# EAGLE design ESP32 Alarm (EAGLE 9.6.2)
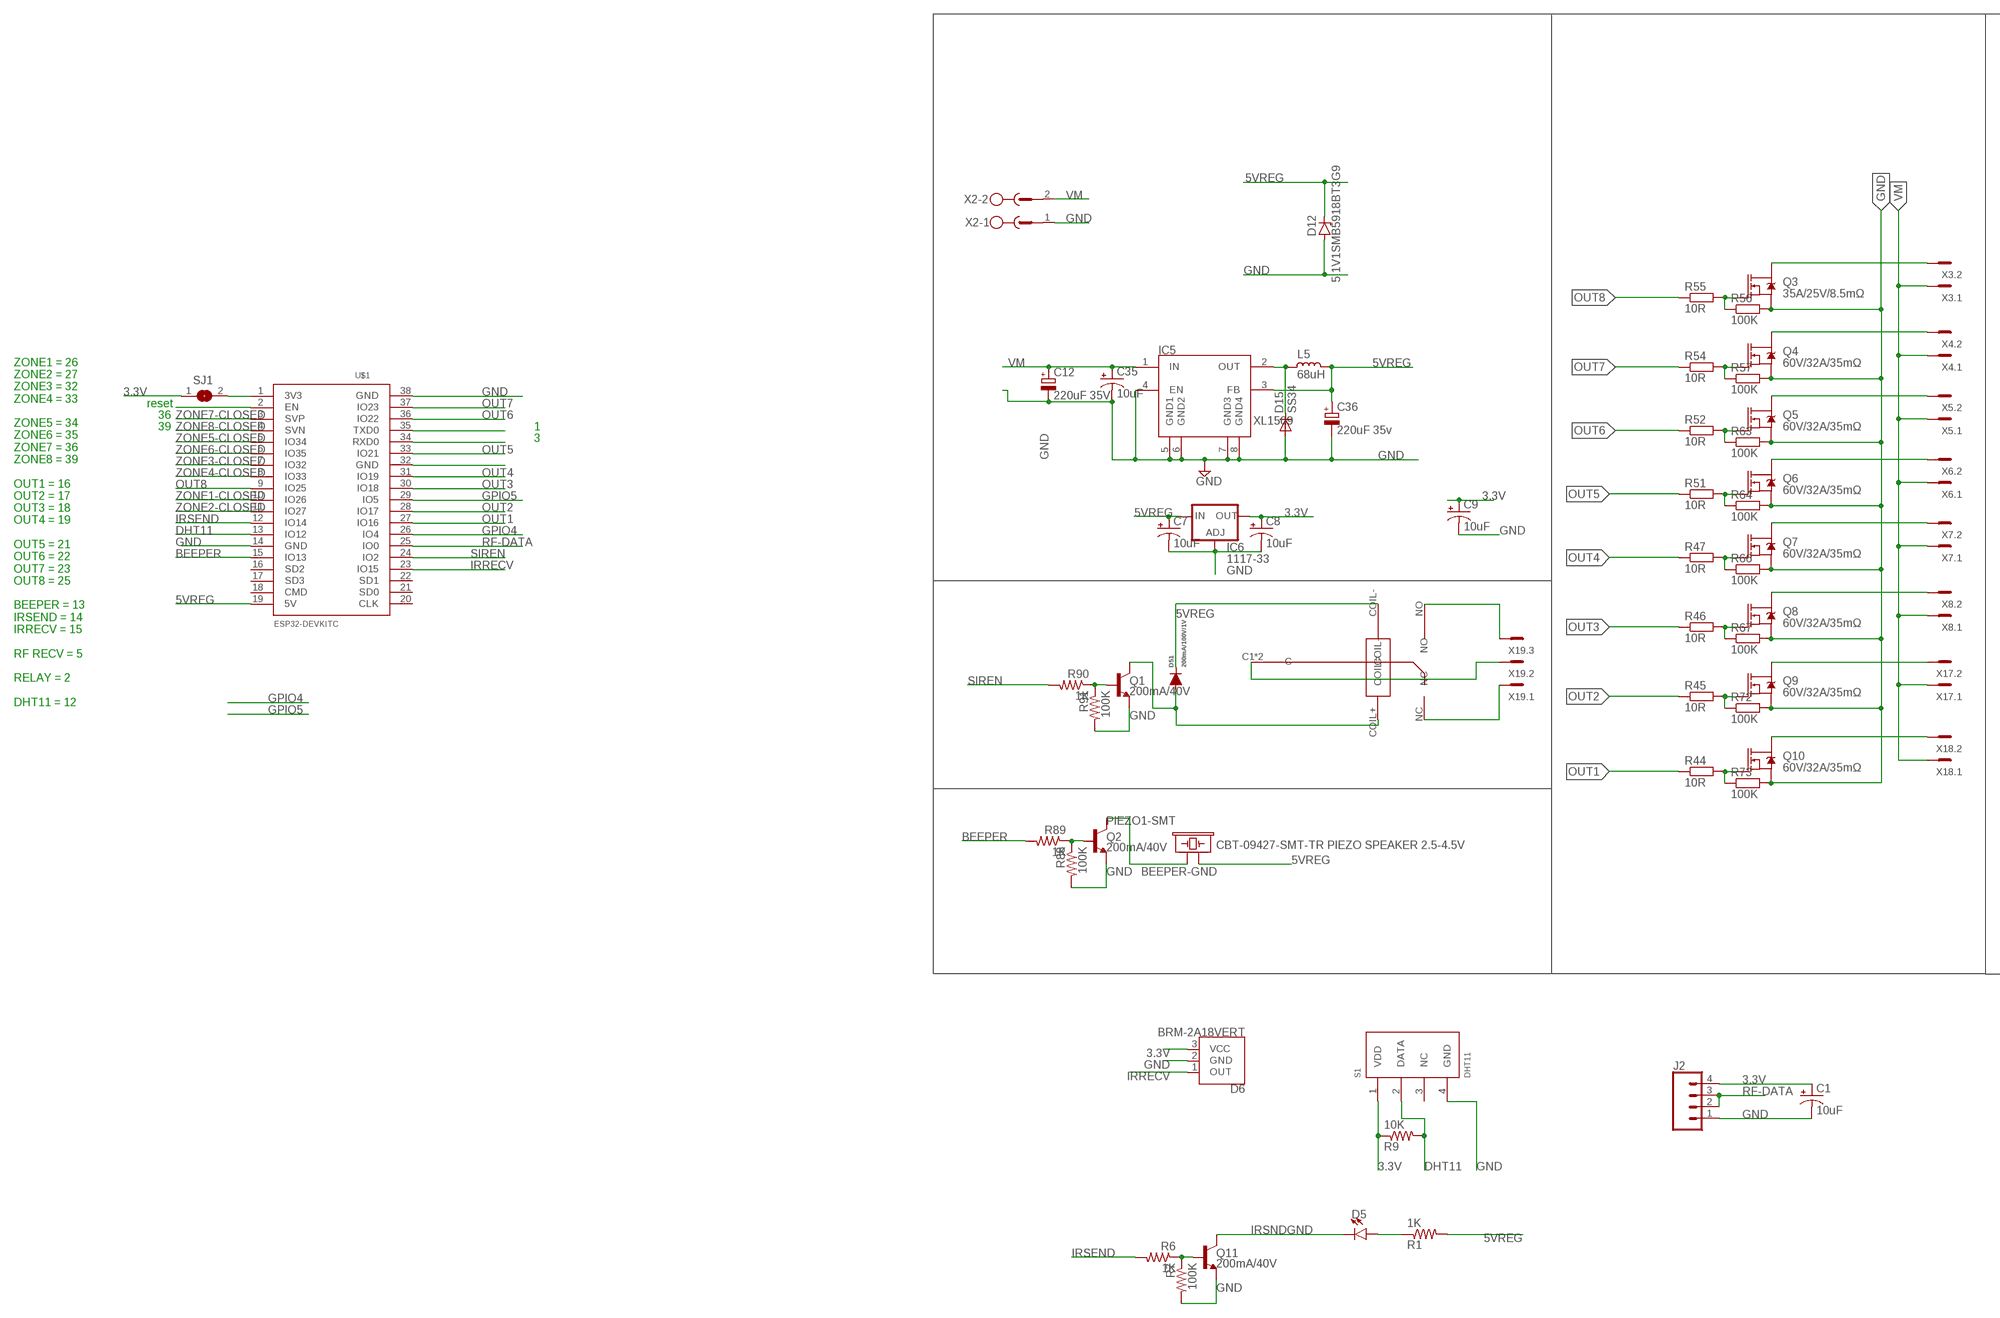
[diagram p0: schematic, sheet 1, part 1 of 2]
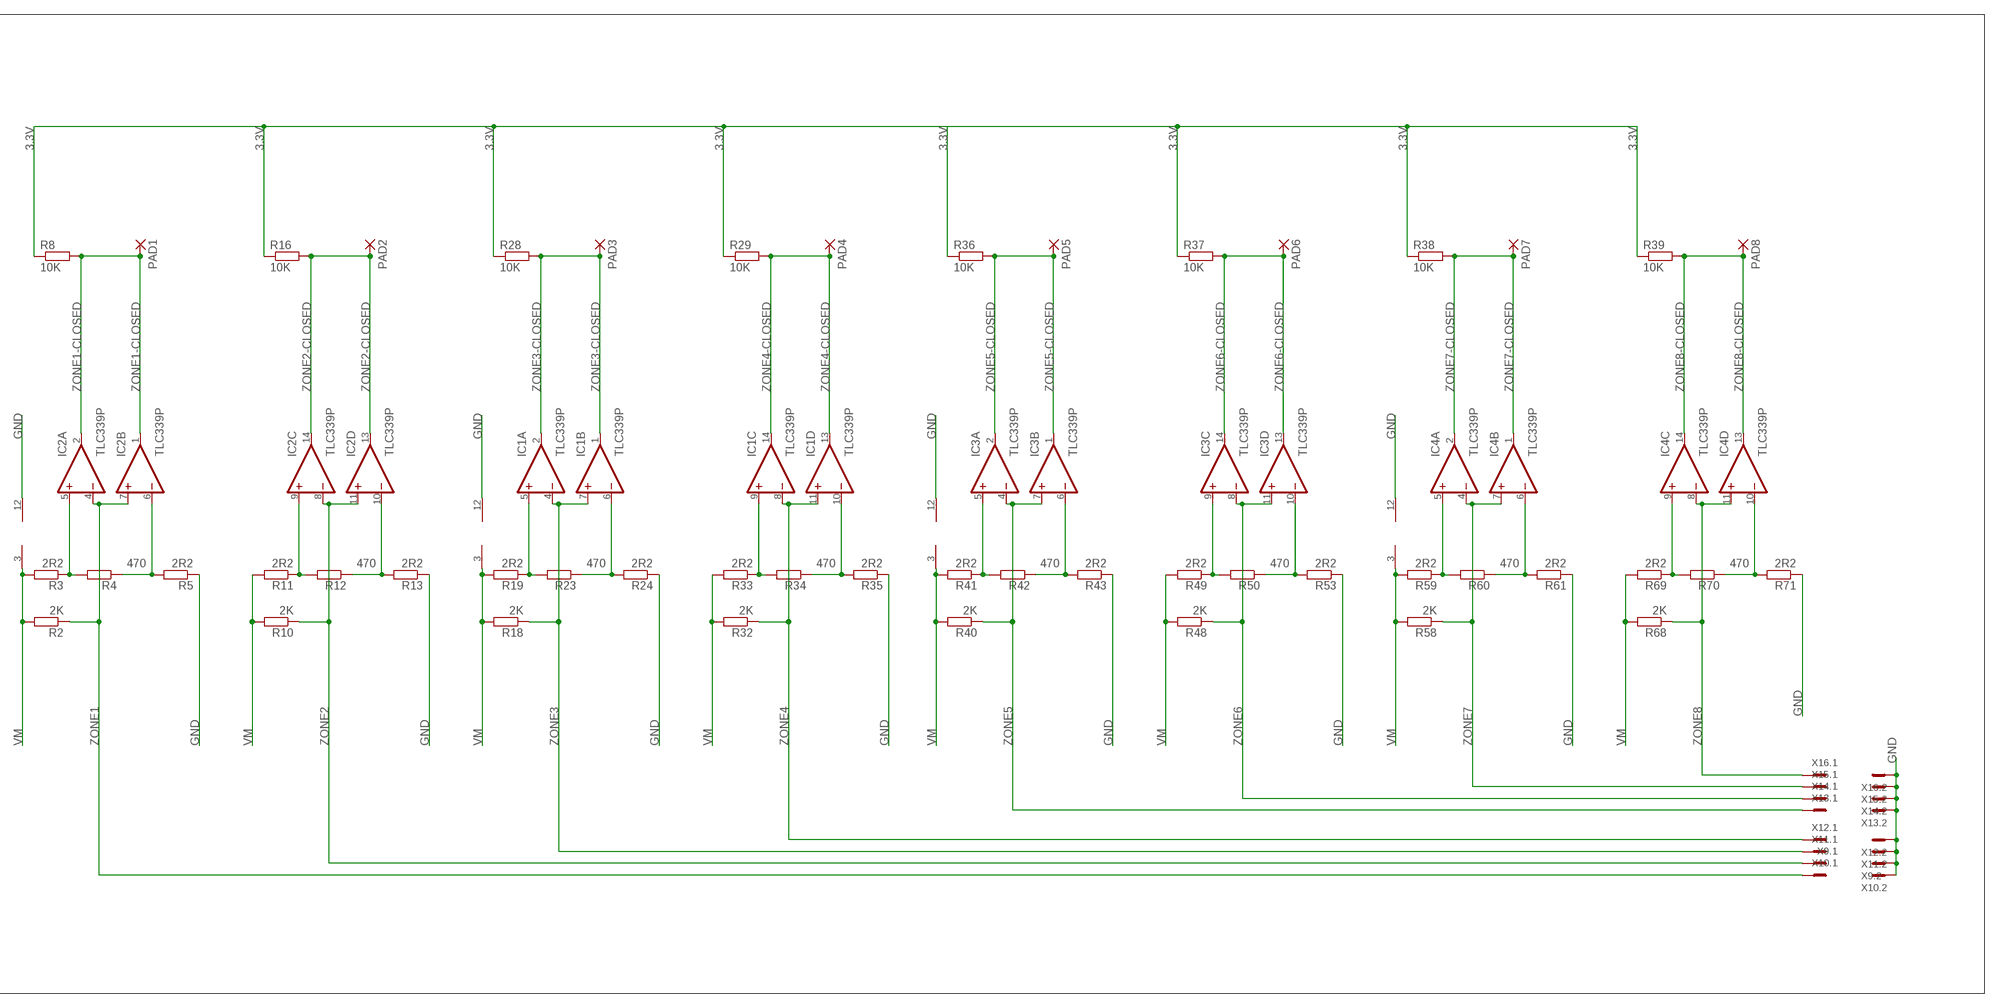
[diagram p1: schematic, sheet 1, part 2 of 2]

## Parts
C1  10uF  CAP_POL1206  [EIA3216]
C7  10uF  CAP_POL1206  [EIA3216]
C8  10uF  CAP_POL1206  [EIA3216]
C9  10uF  CAP_POL1206  [EIA3216]
C12  220uF 35V  CPOL-EUE3.5-8  [E3,5-8]
C35  10uF  CAP_POL1206  [EIA3216]
C36  220uF 35v  CPOL-EUE3.5-8  [E3,5-8]
D5  LED3MM  [LED_3MM]
D6  BRM-2A18VERT  [BRM-2508_VERT]
D12  5.1V1SMB5918BT3G9  ZENER-DIODESMB  [SMB]
D15  SS34  DIODE-DO-214AC  [DO-214AC]
D51  200mA/100V/1V  DIODE-KIT  [DIODE-1N4148-KIT]
IC1  TLC339P  [DIL14]
IC2  TLC339P  [DIL14]
IC3  TLC339P  [DIL14]
IC4  TLC339P  [DIL14]
IC5  XL1509  [SO08]
IC6  1117-33  LD117AS33TR  [SOT223]
J1  JRC-21F-4100  [JRC-21F-4100]
J2  CONN_04LOCK  [1X04_LOCK]
L5  68uH  L_CD75  [CD75]
PAD1  2,15/1,0  [2,15/1,0]
PAD2  2,15/1,0  [2,15/1,0]
PAD3  2,15/1,0  [2,15/1,0]
PAD4  2,15/1,0  [2,15/1,0]
PAD5  2,15/1,0  [2,15/1,0]
PAD6  2,15/1,0  [2,15/1,0]
PAD7  2,15/1,0  [2,15/1,0]
PAD8  2,15/1,0  [2,15/1,0]
PIEZO1-SMT  CBT-09427-SMT-TR PIEZO SPEAKER 2.5-4.5V  BUZZER-PTH  [BUZZER-12MM]
Q1  200mA/40V  TRANS_NPN-2N3904  [TO-92]
Q2  200mA/40V  TRANS_NPN-2N3904  [TO-92]
Q3  35A/25V/8.5mΩ  MOSFET-NCH-FDD8780  [DPAK]
Q4  60V/32A/35mΩ  MOSFET-NCH-FQP30N06L  [TO220V]
Q5  60V/32A/35mΩ  MOSFET-NCH-FQP30N06L  [TO220V]
Q6  60V/32A/35mΩ  MOSFET-NCH-FQP30N06L  [TO220V]
Q7  60V/32A/35mΩ  MOSFET-NCH-FQP30N06L  [TO220V]
Q8  60V/32A/35mΩ  MOSFET-NCH-FQP30N06L  [TO220V]
Q9  60V/32A/35mΩ  MOSFET-NCH-FQP30N06L  [TO220V]
Q10  60V/32A/35mΩ  MOSFET-NCH-FQP30N06L  [TO220V]
Q11  200mA/40V  TRANS_NPN-2N3904  [TO-92]
R1  1K  R-US_0204/7  [0204/7]
R2  2K  R-EU_0204/7  [0204/7]
R3  2R2  R-EU_0204/7  [0204/7]
R4  470  R-EU_0204/7  [0204/7]
R5  2R2  R-EU_0204/7  [0204/7]
R6  1K  R-US_0204/7  [0204/7]
R7  100K  R-US_0204/7  [0204/7]
R8  10K  R-EU_0204/7  [0204/7]
R9  10K  R-US_0204/7  [0204/7]
R10  2K  R-EU_0204/7  [0204/7]
R11  2R2  R-EU_0204/7  [0204/7]
R12  470  R-EU_0204/7  [0204/7]
R13  2R2  R-EU_0204/7  [0204/7]
R16  10K  R-EU_0204/7  [0204/7]
R18  2K  R-EU_0204/7  [0204/7]
R19  2R2  R-EU_0204/7  [0204/7]
R23  470  R-EU_0204/7  [0204/7]
R24  2R2  R-EU_0204/7  [0204/7]
R28  10K  R-EU_0204/7  [0204/7]
R29  10K  R-EU_0204/7  [0204/7]
R32  2K  R-EU_0204/7  [0204/7]
R33  2R2  R-EU_0204/7  [0204/7]
R34  470  R-EU_0204/7  [0204/7]
R35  2R2  R-EU_0204/7  [0204/7]
R36  10K  R-EU_0204/7  [0204/7]
R37  10K  R-EU_0204/7  [0204/7]
R38  10K  R-EU_0204/7  [0204/7]
R39  10K  R-EU_0204/7  [0204/7]
R40  2K  R-EU_0204/7  [0204/7]
R41  2R2  R-EU_0204/7  [0204/7]
R42  470  R-EU_0204/7  [0204/7]
R43  2R2  R-EU_0204/7  [0204/7]
R44  10R  R-EU_0204/7  [0204/7]
R45  10R  R-EU_0204/7  [0204/7]
R46  10R  R-EU_0204/7  [0204/7]
R47  10R  R-EU_0204/7  [0204/7]
R48  2K  R-EU_0204/7  [0204/7]
R49  2R2  R-EU_0204/7  [0204/7]
R50  470  R-EU_0204/7  [0204/7]
R51  10R  R-EU_0204/7  [0204/7]
R52  10R  R-EU_0204/7  [0204/7]
R53  2R2  R-EU_0204/7  [0204/7]
R54  10R  R-EU_0204/7  [0204/7]
R55  10R  R-EU_0204/7  [0204/7]
R56  100K  R-EU_0204/7  [0204/7]
R57  100K  R-EU_0204/7  [0204/7]
R58  2K  R-EU_0204/7  [0204/7]
R59  2R2  R-EU_0204/7  [0204/7]
R60  470  R-EU_0204/7  [0204/7]
R61  2R2  R-EU_0204/7  [0204/7]
R63  100K  R-EU_0204/7  [0204/7]
R64  100K  R-EU_0204/7  [0204/7]
R66  100K  R-EU_0204/7  [0204/7]
R67  100K  R-EU_0204/7  [0204/7]
R68  2K  R-EU_0204/7  [0204/7]
R69  2R2  R-EU_0204/7  [0204/7]
R70  470  R-EU_0204/7  [0204/7]
R71  2R2  R-EU_0204/7  [0204/7]
R72  100K  R-EU_0204/7  [0204/7]
R73  100K  R-EU_0204/7  [0204/7]
R88  100K  R-US_0204/7  [0204/7]
R89  1K  R-US_0204/7  [0204/7]
R90  1K  R-US_0204/7  [0204/7]
R91  100K  R-US_0204/7  [0204/7]
S1  DHT11  [DHT11]
SJ1  SJ  [SJ]
U$1  ESP32DEVKITC  [ESP32-DEVKITC]
X2  MSTBV2  [MSTBV2]
X3  MCV2  [MCV2]
X4  MCV2  [MCV2]
X5  MCV2  [MCV2]
X6  MCV2  [MCV2]
X7  MCV2  [MCV2]
X8  MCV2  [MCV2]
X9  MCV2  [MCV2]
X10  MCV2  [MCV2]
X11  MCV2  [MCV2]
X12  MCV2  [MCV2]
X13  MCV2  [MCV2]
X14  MCV2  [MCV2]
X15  MCV2  [MCV2]
X16  MCV2  [MCV2]
X17  MCV2  [MCV2]
X18  MCV2  [MCV2]
X19  MCV3  [MCV3]

## Nets
3.3V: C1.A(+) C8.A(+) C9.A(+) D6.3(VCC) IC6.4(OUT) J2.4 R8.1 R9.1 R16.1 R28.1 R29.1 R36.1 R37.1 R38.1 R39.1 S1.1(VDD) SJ1.1
5VREG: C7.A(+) C36.+ D12.C D51.C IC5.3(FB) IC6.3(IN) J1.COIL- L5.1 PIEZO1-SMT.+ R1.2 U$1.19(5V)
BEEPER: R89.2 U$1.15(IO13)
BEEPER-GND: PIEZO1-SMT.- Q2.3(C)
COIL-1: D51.A J1.COIL+(COIL=) Q1.3(C)
DHT11: R9.2 S1.2(DATA) U$1.13(IO12)
GND: C1.C(-) C7.C(-) C8.C(-) C9.C(-) C12.- C35.C(-) C36.- D6.2(GND) D12.A D15.2(A) IC1.12(P:V-) IC2.12(P:V-) IC3.12(P:V-) IC4.12(P:V-) IC5.4(EN) IC5.5(GND1) IC5.6(GND2) IC5.7(GND3) IC5.8(GND4) IC6.1(ADJ) J2.1 Q1.1(E) Q2.1(E) Q3.3(S) Q4.3(S) Q5.3(S) Q6.3(S) Q7.3(S) Q8.3(S) Q9.3(S) Q10.3(S) Q11.1(E) R5.1 R7.2 R13.1 R24.1 R35.1 R43.1 R53.1 R56.2 R57.2 R61.1 R63.2 R64.2 R66.2 R67.2 R71.1 R72.2 R73.2 R88.2 R91.2 S1.4(GND) U$1.14(GND) U$1.38(GND) X2.1 X9.2 X10.2 X11.2 X12.2 X13.2 X14.2 X15.2 X16.2
GPIO4: U$1.26(IO4)
GPIO5: U$1.29(IO5)
IRRECV: D6.1(OUT) U$1.23(IO15)
IRSEND: R6.2 U$1.12(IO14)
IRSNDGND: D5.K(C) Q11.3(C)
N$1: J1.C1(C) J1.C2(C) X19.2
N$2: IC2.5(A:+IN) R3.1 R4.2
N$3: D15.1(C) IC5.2(OUT) L5.2
N$4: IC2.6(B:-IN) R4.1 R5.2
N$5: IC1.5(A:+IN) R19.1 R23.2
N$6: IC1.6(B:-IN) R23.1 R24.2
N$7: Q9.2(D) X17.2
N$8: D5.A R1.1
N$9: Q11.2(B) R6.1 R7.1
N$11: Q2.2(B) R88.1 R89.1
N$13: IC2.9(C:+IN) R11.1 R12.2
N$14: IC2.10(D:-IN) R12.1 R13.2
N$16: Q10.1(G) R44.2 R73.1
N$17: J1.NC X19.1
N$18: Q9.1(G) R45.2 R72.1
N$19: Q8.1(G) R46.2 R67.1
N$20: IC1.9(C:+IN) R33.1 R34.2
N$21: IC1.10(D:-IN) R34.1 R35.2
N$23: Q7.1(G) R47.2 R66.1
N$24: IC3.5(A:+IN) R41.1 R42.2
N$25: IC3.6(B:-IN) R42.1 R43.2
N$26: J1.NO X19.3
N$27: Q6.1(G) R51.2 R64.1
N$28: IC3.9(C:+IN) R49.1 R50.2
N$29: IC3.10(D:-IN) R50.1 R53.2
N$30: SJ1.2 U$1.1(3V3)
N$31: Q5.1(G) R52.2 R63.1
N$32: IC4.5(A:+IN) R59.1 R60.2
N$33: IC4.6(B:-IN) R60.1 R61.2
N$35: Q4.1(G) R54.2 R57.1
N$36: IC4.9(C:+IN) R69.1 R70.2
N$37: Q3.1(G) R55.2 R56.1
N$38: IC4.10(D:-IN) R70.1 R71.2
N$41: Q3.4(D) X3.2
N$42: Q4.2(D) X4.2
N$43: Q5.2(D) X5.2
N$44: Q6.2(D) X6.2
N$45: Q7.2(D) X7.2
N$46: Q10.2(D) X18.2
N$47: Q8.2(D) X8.2
N$57: U$1.32(GND)
N$59: U$1.34(RXD0)
N$60: U$1.35(TXD0)
N$67: U$1.2(EN)
N$74: Q1.2(B) R90.1 R91.1
OUT1: R44.1 U$1.27(IO16)
OUT2: R45.1 U$1.28(IO17)
OUT3: R46.1 U$1.30(IO18)
OUT4: R47.1 U$1.31(IO19)
OUT5: R51.1 U$1.33(IO21)
OUT6: R52.1 U$1.36(IO22)
OUT7: R54.1 U$1.37(IO23)
OUT8: R55.1 U$1.9(IO25)
RF-DATA: J2.2 J2.3 U$1.25(IO0)
SIREN: R90.2 U$1.24(IO2)
VM: C12.+ C35.A(+) IC1.3(P:V+) IC2.3(P:V+) IC3.3(P:V+) IC4.3(P:V+) IC5.1(IN) R2.2 R3.2 R10.2 R11.2 R18.2 R19.2 R32.2 R33.2 R40.2 R41.2 R48.2 R49.2 R58.2 R59.2 R68.2 R69.2 X2.2 X3.1 X4.1 X5.1 X6.1 X7.1 X8.1 X17.1 X18.1
ZONE1: IC2.4(A:-IN) IC2.7(B:+IN) R2.1 X10.1
ZONE1-CLOSED: IC2.1(B:OUT) IC2.2(A:OUT) PAD1.1(P) R8.2 U$1.10(IO26)
ZONE2: IC2.8(C:-IN) IC2.11(D:+IN) R10.1 X9.1
ZONE2-CLOSED: IC2.13(D:OUT) IC2.14(C:OUT) PAD2.1(P) R16.2 U$1.11(IO27)
ZONE3: IC1.4(A:-IN) IC1.7(B:+IN) R18.1 X11.1
ZONE3-CLOSED: IC1.1(B:OUT) IC1.2(A:OUT) PAD3.1(P) R28.2 U$1.7(IO32)
ZONE4: IC1.8(C:-IN) IC1.11(D:+IN) R32.1 X12.1
ZONE4-CLOSED: IC1.13(D:OUT) IC1.14(C:OUT) PAD4.1(P) R29.2 U$1.8(IO33)
ZONE5: IC3.4(A:-IN) IC3.7(B:+IN) R40.1 X13.1
ZONE5-CLOSED: IC3.1(B:OUT) IC3.2(A:OUT) PAD5.1(P) R36.2 U$1.5(IO34)
ZONE6: IC3.8(C:-IN) IC3.11(D:+IN) R48.1 X14.1
ZONE6-CLOSED: IC3.13(D:OUT) IC3.14(C:OUT) PAD6.1(P) R37.2 U$1.6(IO35)
ZONE7: IC4.4(A:-IN) IC4.7(B:+IN) R58.1 X15.1
ZONE7-CLOSED: IC4.1(B:OUT) IC4.2(A:OUT) PAD7.1(P) R38.2 U$1.3(SVP)
ZONE8: IC4.8(C:-IN) IC4.11(D:+IN) R68.1 X16.1
ZONE8-CLOSED: IC4.13(D:OUT) IC4.14(C:OUT) PAD8.1(P) R39.2 U$1.4(SVN)
Unconnected: S1.3(NC) U$1.16(SD2) U$1.17(SD3) U$1.18(CMD) U$1.20(CLK) U$1.21(SD0) U$1.22(SD1)

## Notes on the sheet
- reset
- 36
- 39 | 1
- 3
- ZONE1 = 26 
  ZONE2 = 27
  ZONE3 = 32
  ZONE4 = 33
  
  ZONE5 = 34
  ZONE6 = 35
  ZONE7 = 36
  ZONE8 = 39
  
  OUT1 = 16
  OUT2 = 17
  OUT3 = 18
  OUT4 = 19
  
  OUT5 = 21
  OUT6 = 22
  OUT7 = 23
  OUT8 = 25
  
  BEEPER = 13
  IRSEND = 14
  IRRECV = 15
  
  RF RECV = 5
  
  RELAY = 2
  
  DHT11 = 12

## Library data of the parts
C1 C7-C9 C35 = SparkFun:CAP_POL: Capacitor Polarized These are standard SMD and PTH capacitors. Normally 10uF, 47uF, and 100uF in electrolytic and tantalum varieties. Always verify the external diameter of the through hole cap, it varies with capacity, voltage, and manufacturer. The EIA devices should be standard.
C12 C36 = rcl:CPOL-EU: POLARIZED CAPACITOR, European symbol
D5 = SparkFun-LED:LED: LED (Generic) Standard schematic elements and footprints for 5mm, 3mm, 1206, and 0603 sized LEDs. Generic LEDs with no color specified.; PROD_ID: DIO-08794
D6 = SparkFun-Sensors:BRM-2A18: BRM-2A18 IR Receiver The BRM-2A18 is miniaturized infrared receiver for remote control and other applications requiring improved ambient light rejection. Vertical package is a primary component on the ZX Distance and Gesture Sensor. RA package is not currently in-use. Example Datasheet <http://www.sinoskysun.com/upload/20110512/201105120447164615.PDF> SparkFun Products ZX Distance and Gesture Sensor <https://www.sparkfun.com/products/12780> (COM-12780); PROD_ID: COMP-12505
D12 = diode:ZENER-DIODE: Z-Diode
D15 = dp_devices:DIODE: Various Diode Packages
D51 = SparkFun-DiscreteSemi:DIODE: Diode These are standard reverse protection diodes and small signal diodes. SparkFun Products: SparkFun SparkPunk Sound Kit <https://www.sparkfun.com/products/11177> SparkFun ESP8266 Thing <https://www.sparkfun.com/products/13231>; PROD_ID: DIO-08378
IC1-IC4 = linear:TLC339: COMPARATOR
IC5 = Cohesion_parts:XL1509
IC6 = v-reg:LD117A?*: Low drop fixed and adjustable positive voltage regulators 1 A Source: http://www.st.com/stonline/products/literature/ds/7194/ld1117axx.pdf
J1 = JRC-21F:JRC-21F-4100
J2 = SparkFun-Connectors:CONN_04: Multi connection point. Often used as Generic Header-pin footprint for 0.1 inch spaced/style header connections On any of the 0.1 inch spaced packages, you can populate with these: Break Away Headers - Straight <https://www.sparkfun.com/products/116> (PRT-00116) Break Away Male Headers - Right Angle <https://www.sparkfun.com/products/553> (PRT-00553) Female Headers <https://www.sparkfun.com/products/115> (PRT-00115) Break Away Headers - Machine Pin <https://www.sparkfun.com/products/117> (PRT-00117) Break Away Female Headers - Swiss Machine Pin <https://www.sparkfun.com/products/743> (PRT-00743) For SCREWTERMINALS and SPRING TERMINALS visit here: Screw Terimnals on SparkFun.com <https://www.sparkfun.com/search/results?term=Screw+Terminals> (5mm/3.5mm/2.54mm spacing) This device is also useful as a general connection point to wire up your design to another part of your project. Our various solder wires solder well into these plated through hole pads. Hook-Up Wire - Assortment (Stranded, 22 AWG) <https://www.sparkfun.com/products/11375> (PRT-11375) Hook-Up Wire - Assortment (Solid Core, 22 AWG) <https://www.sparkfun.com/products/11367> (PRT-11367) View the entire wire category on our website here <https://www.sparkfun.com/categories/141> Special notes: Molex polarized connector foot print use with SKU : PRT-08231 with associated crimp pins and housings. 1MM SMD Version SKU: PRT-10208; PROD_ID: CONN-09696
L5 = rc-master-smd:L_: INDUCTOR
PAD1-PAD8 = wirepad:2,15/1,0: THROUGH-HOLE PAD
PIEZO1-SMT = SparkFun-Electromechanical:BUZZER: Buzzer Small round buzzers that operate around the audible 2kHz range. You can use these as speakers to create simple music or user interfaces. Variant Overview: PTH - Mini Speaker - PC Mount 12mm 2.048kHz <https://www.sparkfun.com/products/7950> PTH_KIT - Mini Speaker - PC Mount 12mm 2.048kHz <https://www.sparkfun.com/products/7950> KIT simplifies soldering by adding stop mask to one side of the pads. PTH_NO_SILK - Mini Speaker - PC Mount 12mm 2.048kHz <https://www.sparkfun.com/products/7950> No silkscreen indicator of buzzer outline. PTH_KIT_NO_SILK - Mini Speaker - PC Mount 12mm 2.048kHz <https://www.sparkfun.com/products/7950> KIT package w/o silkscreen SMD - Buzzer Audio Magnetic (CCV-084B16) SMD buzzer used on, e.g. the LilyPad Buzzer <https://www.sparkfun.com/products/8463> and RFID USB Reader <https://www.sparkfun.com/products/9963>. SMD_KIT - Buzzer Audio Magnetic (CCV-084B16) SMD Buzzer with elongated pins to make soldering easier. Used on the SparkFun Simon Says - Surface Mount Soldering Kit <https://www.sparkfun.com/products/10935>.; PROD_ID: COMP-08253; SF_SKU: COM-07950
Q1 Q2 Q11 = SparkFun-DiscreteSemi:TRANS_NPN: NPN transistor Current controlled devices typically used to amplify current or used as a switch. BC547 - COM-08928 <http://www.sparkfun.com/products/8928> (TO-92 45V 100mA) (1.Collector 2.Base 3.Emitter) 2N3904 - COM-00521 <http://www.sparkfun.com/products/521> (TO-92 40V 200mA) (1.Emitter 2.Base 3.Collector) P2N2222A - COM-12852 <http://www.sparkfun.com/products/12852> (TO-92 40V 600mA) (1.Collector 2.Base 3.Emitter); PROD_ID: TRANS-08447
Q3 = SparkFun-DiscreteSemi:MOSFET-NCH: N-channel MOSFETs Voltage controlled devices that allow control of high current outputs. SparkFun Products: SparkFun OpenScale <https://www.sparkfun.com/products/13261> SparkFun Digital Sandbox <https://www.sparkfun.com/products/12651> SparkFun Monster Moto Shield <https://www.sparkfun.com/products/10182> SparkFun MOSFET Power Controller <https://www.sparkfun.com/products/11214>; PROD_ID: TRANS-09984
Q4-Q10 = SparkFun-DiscreteSemi:MOSFET-NCH: N-channel MOSFETs Voltage controlled devices that allow control of high current outputs. SparkFun Products: SparkFun OpenScale <https://www.sparkfun.com/products/13261> SparkFun Digital Sandbox <https://www.sparkfun.com/products/12651> SparkFun Monster Moto Shield <https://www.sparkfun.com/products/10182> SparkFun MOSFET Power Controller <https://www.sparkfun.com/products/11214>; PROD_ID: TRANS-10060
R1 R6 R7 R9 R88-R91 = adafruit:R-US_: RESISTOR, American symbol
R2-R5 R8 R10-R13 R16 R18 R19 R23 R24 R28 R29 R32-R61 R63 R64 R66-R73 = rcl:R-EU_: RESISTOR, European symbol; SPICEPREFIX: R
S1 = dht:DHT11
SJ1 = jumper:SJ: SMD solder JUMPER
U$1 = ESP32-DEVKITC:ESP32DEVKITC
X2 = con-phoenix-500:MSTBV2: PHOENIX; OC_FARNELL: unknown; OC_NEWARK: unknown
X3-X18 = con-phoenix-381_l:MCV2: Mini-Combicon 3.81mm vertikal 2polig MCV 1,5/2-G-3,81 Artikel-Nr. 1803426
X19 = con-phoenix-381_l:MCV3: Mini-Combicon 3.81mm vertikal 3polig MCV 1,5/3-G-3,81 Artikel-Nr. 1803439

## Net classes
0 default: width 0.203 mm, clearance 0.152 mm
1 power: width 0.6 mm, clearance 0.305 mm

## Board
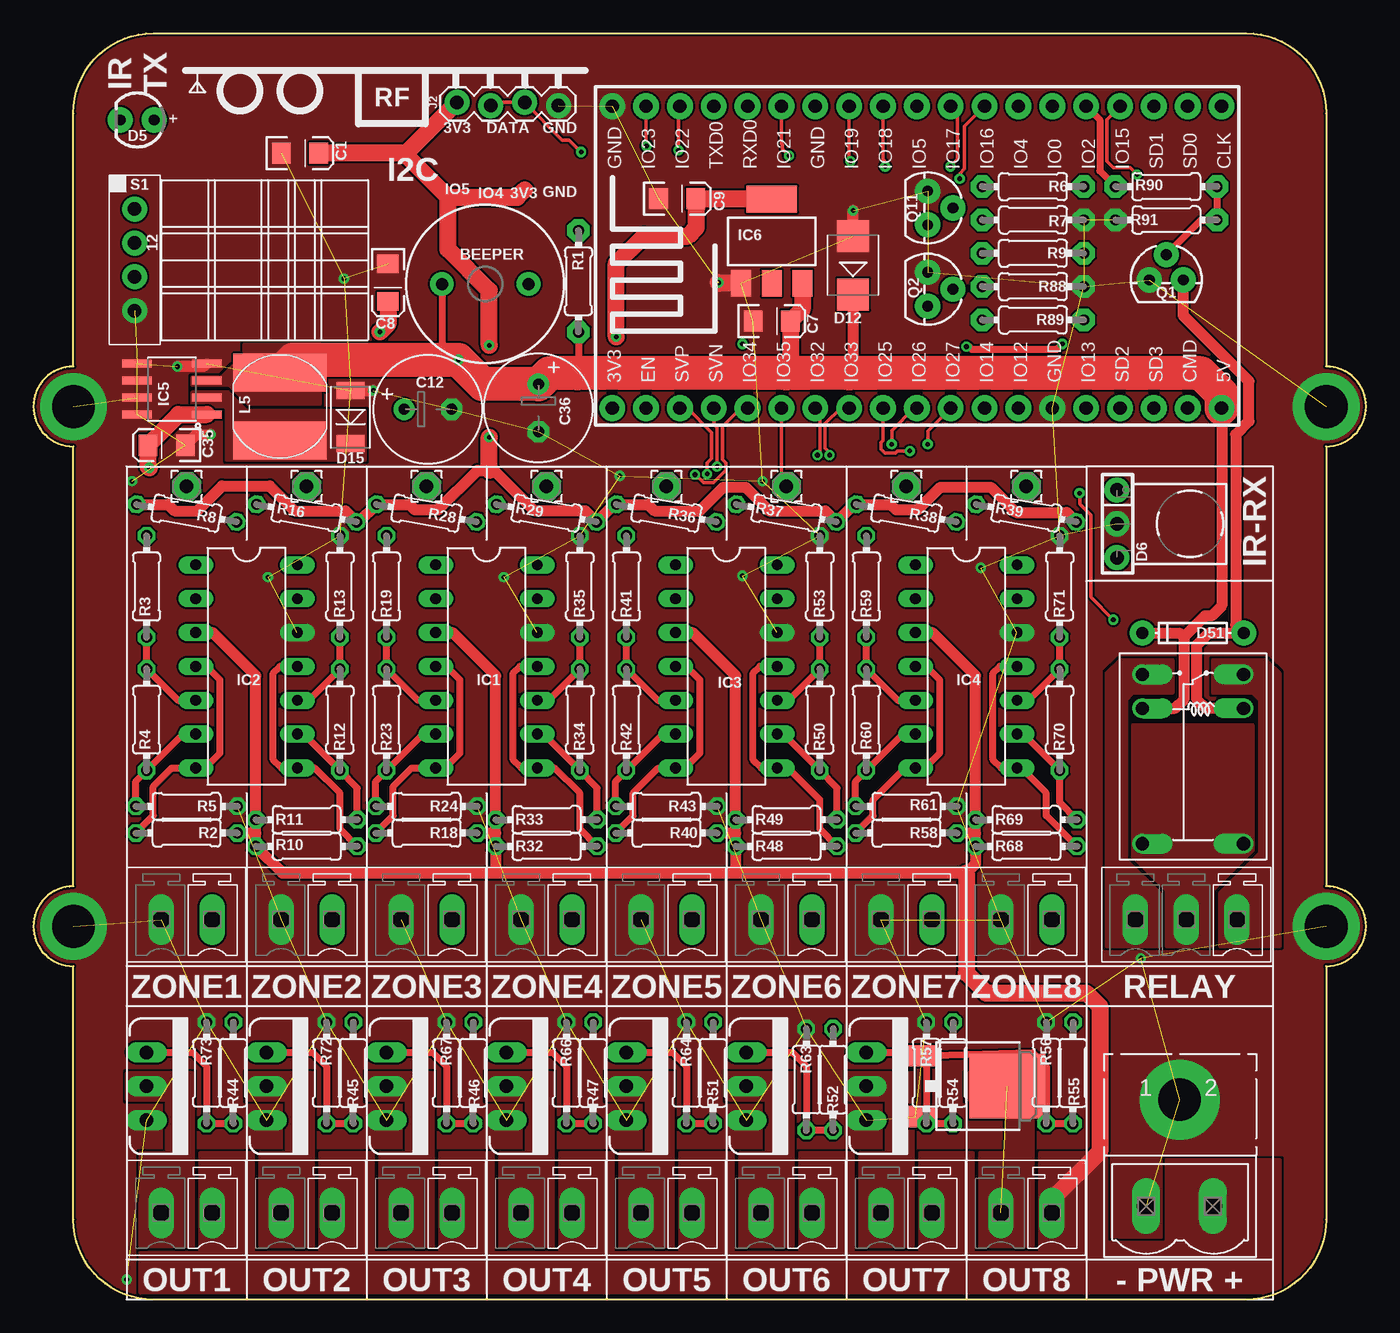
[diagram p2: board, top side]
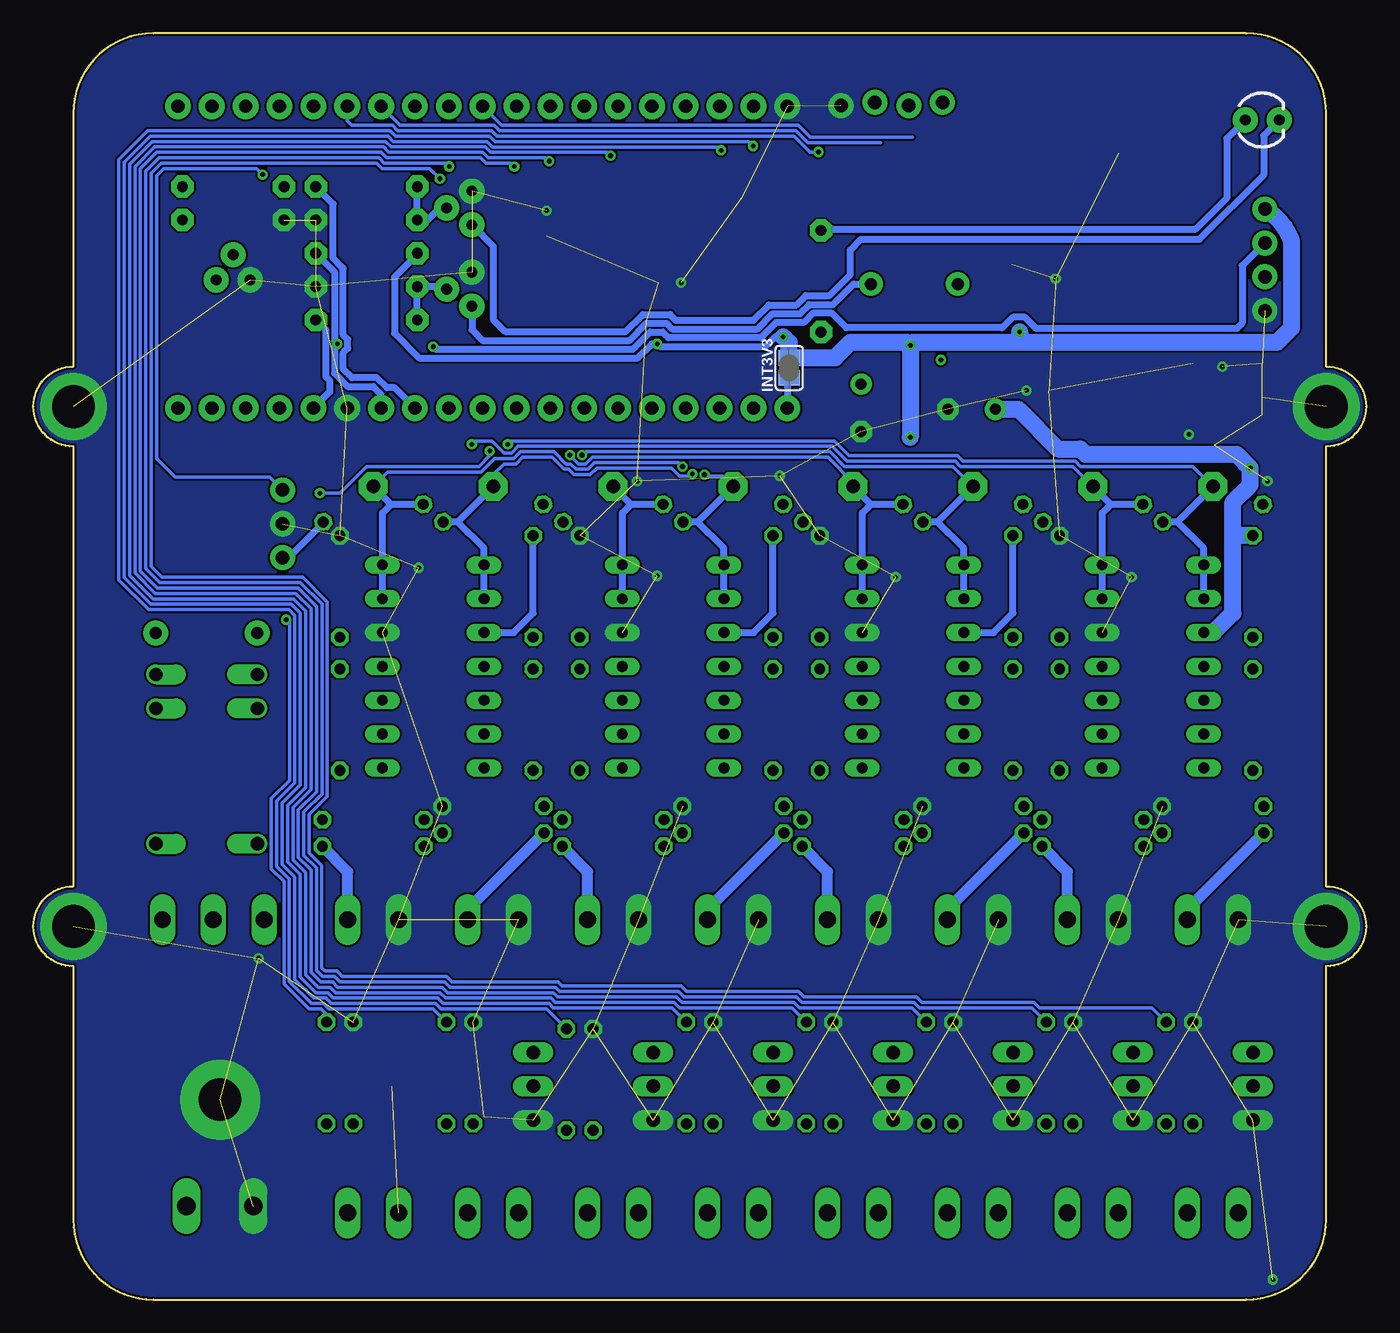
[diagram p3: board, bottom side, seen from below]

Size 100 x 95 mm. Coordinates in mm from the lower left corner, seen from the top.
Outline: 3,6 3,25 arc-180 3,31 3,64 arc-180 3,70 3,89 arc-90 9,95 91,95 arc-90 97,89 97,70 arc-180 97,64 97,31 arc-180 97,25 97,6 arc-90 91,0 9,0 arc-90 3,6
Copper layers (1*16): Top 0.035mm / dielectric 1.5mm / Bottom 0.035mm
Design rules "default *": minimum track width 6mil, minimum drill 0.35mm, track to track 6mil, track to pad 6mil, pad to pad 6mil, via to via 6mil, smd to smd 6mil, copper to edge 6mil, drill to drill 6mil, minimum pad ring 10mil, minimum via ring 8mil, stop-mask expansion 4mil, vias tented up to drill 0mil, thermal gap 10mil

### Footprints (pad centres in the part's own frame; a part is rotated, then mirrored left to right if it is on the bottom)
EIA3216 = smd 1.4 x 1.6: A 1.4,0; C -1.4,0
E3,5-8 = drill 0.813 pad 1.6: + -1.778,0 | drill 0.813 pad 1.6 octagon: - 1.778,0
LED_3MM = drill 0.813 pad 1.88: A -1.27,0; K 1.27,0
BRM-2508_VERT = drill 1.016 pad 1.88: 1 -2.54,0; 2 0,0; 3 2.54,0
SMB = smd 2.4 x 2.4: A 2.2,0; C -2.2,0
DO-214AC = smd 1.27 x 2.1: 1 -1.98,0; 2 1.98,0
DIODE-1N4148-KIT = drill 0.9 pad 1.88: A -3.81,0; C 3.81,0
DIL14 = drill 0.813 long: 1 -7.62,-3.81; 2 -5.08,-3.81; 3 -2.54,-3.81; 4 0,-3.81; 5 2.54,-3.81; 6 5.08,-3.81; 7 7.62,-3.81; 8 7.62,3.81; 9 5.08,3.81; 10 2.54,3.81; 11 0,3.81; 12 -2.54,3.81; 13 -5.08,3.81; 14 -7.62,3.81
SO08 = smd 0.61 x 2.21: 1 -1.905,-2.616; 2 -0.635,-2.616; 3 0.635,-2.616; 4 1.905,-2.616; 5 1.905,2.616; 6 0.635,2.616; 7 -0.635,2.616; 8 -1.905,2.616
SOT223 = smd 1.5 x 2: 1 -2.3,-3.15; 2 0,-3.15; 3 2.3,-3.15 | smd 3.8 x 2: 4 0,3.15
JRC-21F-4100 = drill 1 offset: C1 -4.3,3.8; C2 -4.3,-3.8; COIL+ 5.85,-3.8; COIL- 5.85,3.8; NC 8.4,-3.8; NO 8.4,3.8
1X04_LOCK = drill 1.016 pad 1.88: 1 0,0.127; 2 2.54,-0.127; 3 5.08,0.127; 4 7.62,-0.127
CD75 = smd 7 x 2.85: 1 0,2.54; 2 0,-2.54
2,15/1,0 = drill 1.016 pad 2.159 octagon: 1 0,0
BUZZER-12MM = drill 0.9 pad 1.778: + 3.25,0; - -3.25,0
TO-92 = drill 0.813 pad 1.88: 1 -1.27,0; 2 0,1.905; 3 1.27,0
DPAK = smd 1.6 x 3: 1 -2.28,-5.31; 3 2.28,-5.31 | smd 4.826 x 5.715: 4 0,1.588
TO220V = drill 1.016 long: 1 -2.54,0; 2 0,0; 3 2.54,0
0204/7 = drill 0.813 pad 1.676 octagon: 1 -3.81,0; 2 3.81,0
0204/7' = drill 0.813 octagon: 1 -3.81,0; 2 3.81,0
DHT11 = drill 1.016 pad 1.88: 1 -3.81,0; 2 -1.27,0; 3 1.27,0; 4 3.81,0
SJ = smd 1.168 x 1.6: 1 -0.762,0; 2 0.762,0
ESP32-DEVKITC = drill 1 pad 1.93: 1 -22.87,-11.42; 2 -20.33,-11.42; 3 -17.79,-11.42; 4 -15.25,-11.42; 5 -12.71,-11.42; 6 -10.17,-11.42; 7 -7.63,-11.42; 8 -5.09,-11.42; 9 -2.55,-11.42; 10 -0.01,-11.42; 11 2.53,-11.42; 12 5.07,-11.42; 13 7.61,-11.42; 14 10.15,-11.42; 15 12.69,-11.42; 16 15.23,-11.42; 17 17.77,-11.42; 18 20.31,-11.42; 19 22.85,-11.42; 20 22.85,11.23; 21 20.31,11.23; 22 17.77,11.23; 23 15.23,11.23; 24 12.69,11.23; 25 10.15,11.23; 26 7.61,11.23; 27 5.07,11.23; 28 2.53,11.23; 29 -0.01,11.23; 30 -2.55,11.23; 31 -5.09,11.23; 32 -7.63,11.23; 33 -10.17,11.23; 34 -12.71,11.23; 35 -15.25,11.23; 36 -17.79,11.23; 37 -20.33,11.23; 38 -22.87,11.23
MSTBV2 = drill 1.397 long: 1 -2.5,0; 2 2.5,0
MCV2 = drill 1.27 pad 1.905 long: 1 -1.905,0; 2 1.905,0
MCV3 = drill 1.27 pad 1.905 long: 1 -3.81,0; 2 0,0; 3 3.81,0

### Placement (x,y rotation side)
C1  20,86 0 top
C7  55.4,73.4 0 top
C8  26.6,76.3 270 top
C9  48.3,82.6 0 top
C12  29.6,66.8 0 top
C35  10,64.1 180 top
C36  37.9,66.9 270 top
D5  7.8,88.5 180 top
D6  81.3,58.2 270 top
D12  61.5,77.6 90 top
D15  23.8,66.2 90 top
D51  87,50 180 top
IC1  34,47.5 270 top
IC2  16,47.5 270 top
IC3  52,47.5 270 top
IC4  70,47.5 270 top
IC5  10.4,68.3 90 top
IC6  55.4,79.4 0 top
J1  87,38.5 90 top
J2  39.4,89.7 180 top
L5  18.5,67 0 top
PAD1  11.5,61 0 top
PAD2  20.5,61 0 top
PAD3  29.5,61 0 top
PAD4  38.5,61 0 top
PAD5  47.5,61 0 top
PAD6  56.5,61 0 top
PAD7  65.5,61 0 top
PAD8  74.5,61 0 top
PIEZO1-SMT  33.9,76.2 180 top
Q1  85,76.5 0 top
Q2  67.1,75.8 270 top
Q3  71.5,16 270 top
Q4  62.5,16 270 top
Q5  53.5,16 270 top
Q6  44.5,16 270 top
Q7  35.5,16 270 top
Q8  26.5,16 270 top
Q9  17.5,16 270 top
Q10  8.5,16 270 top
Q11  67.1,81.9 270 top
R1  40.9,76.4 270 top
R2  2K  [0204/7']  11.5,35 0 top
R3  2R2  [0204/7']  8.5,53.5 90 top
R4  470  [0204/7']  8.5,43.5 90 top
R5  2R2  [0204/7']  11.5,37 180 top
R6  75,83.5 0 top
R7  75,81 0 top
R8  10K  [0204/7']  11.5,59 350 top
R9  75,78.5 0 top
R10  2K  [0204/7']  20.5,34 180 top
R11  2R2  [0204/7']  20.5,36 180 top
R12  470  [0204/7']  23,43.5 270 top
R13  2R2  [0204/7']  23,53.5 270 top
R16  10K  [0204/7']  20.5,59 170 top
R18  2K  [0204/7']  29.5,35 0 top
R19  2R2  [0204/7']  26.5,53.5 90 top
R23  470  [0204/7']  26.5,43.5 90 top
R24  2R2  [0204/7']  29.5,37 180 top
R28  10K  [0204/7']  29.5,59 350 top
R29  10K  [0204/7']  38.5,59 170 top
R32  2K  [0204/7']  38.5,34 180 top
R33  2R2  [0204/7']  38.5,36 180 top
R34  470  [0204/7']  41,43.5 270 top
R35  2R2  [0204/7']  41,53.5 270 top
R36  10K  [0204/7']  47.5,59 350 top
R37  10K  [0204/7']  56.5,59 170 top
R38  10K  [0204/7']  65.5,59 350 top
R39  10K  [0204/7']  74.5,59 170 top
R40  2K  [0204/7']  47.5,35 0 top
R41  2R2  [0204/7']  44.5,53.5 90 top
R42  470  [0204/7']  44.5,43.5 90 top
R43  2R2  [0204/7']  47.5,37 180 top
R44  10R  [0204/7']  15,17 270 top
R45  10R  [0204/7']  24,17 270 top
R46  10R  [0204/7']  33,17 270 top
R47  10R  [0204/7']  42,17 270 top
R48  2K  [0204/7']  56.5,34 180 top
R49  2R2  [0204/7']  56.5,36 180 top
R50  470  [0204/7']  59,43.5 270 top
R51  10R  [0204/7']  51,17 270 top
R52  10R  [0204/7']  60,16.5 270 top
R53  2R2  [0204/7']  59,53.5 270 top
R54  10R  [0204/7']  69,17 270 top
R55  10R  [0204/7']  78,17 270 top
R56  100K  [0204/7']  76,17 90 top
R57  100K  [0204/7']  67,17 90 top
R58  2K  [0204/7']  65.5,35 0 top
R59  2R2  [0204/7']  62.5,53.5 90 top
R60  470  [0204/7']  62.5,43.5 90 top
R61  2R2  [0204/7']  65.5,37 180 top
R63  100K  [0204/7']  58,16.5 90 top
R64  100K  [0204/7']  49,17 90 top
R66  100K  [0204/7']  40,17 90 top
R67  100K  [0204/7']  31,17 90 top
R68  2K  [0204/7']  74.5,34 180 top
R69  2R2  [0204/7']  74.5,36 180 top
R70  470  [0204/7']  77,43.5 270 top
R71  2R2  [0204/7']  77,53.5 270 top
R72  100K  [0204/7']  22,17 90 top
R73  100K  [0204/7']  13,17 90 top
R88  75,76 0 top
R89  75,73.5 0 top
R90  85,83.5 180 top
R91  85,81 180 top
S1  7.6,78 270 top
SJ1  43.3,69.9 270 bottom
U$1  66.3,78.3 0 top
X2  86,7 0 top
X3  74.5,6.5 180 top
X4  65.5,6.5 180 top
X5  56.5,6.5 180 top
X6  47.5,6.5 180 top
X7  38.5,6.5 180 top
X8  29.5,6.5 180 top
X9  20.5,28.5 180 top
X10  11.5,28.5 180 top
X11  29.5,28.5 180 top
X12  38.5,28.5 180 top
X13  47.5,28.5 180 top
X14  56.5,28.5 180 top
X15  65.5,28.5 180 top
X16  74.5,28.5 180 top
X17  20.5,6.5 180 top
X18  11.5,6.5 180 top
X19  86.5,28.5 180 top

### Tracks (layer width: path | path; a pad name or v marks a point on that pad's centre or on a via)
3.3V  (via drill 0.35)
  Top 0.813: R8.1 10.12,59.66 10.62,59.16 12.28,59.16 14.17,61.05 17.73,61.05 19.62,59.16 23.43,59.16 R16.1 24.43,58.34 R28.1 28.22,59.66 28.62,59.26 30.38,59.26 33.32,62.2 34.2,62.2 34.58,62.2 37.62,59.16 41.43,59.16 R29.1 43.58,59.66 R36.1 46.12,59.66 46.62,59.16 49.98,59.16 51.77,60.95 53.43,60.95 55.22,59.16 59.43,59.16 R37.1 61.58,59.66 R38.1 64.32,59.66 64.72,59.26 66.38,59.26 68.07,60.95 71.83,60.95 73.72,59.06 77.53,59.06 R39.1
  Top 1.27: IC6.4 49.75,82.55 | 49.75,82.55 C9.A | v43.73,72.23 43.73,77.73 45.8,79.8 49.1,79.8 49.75,80.45 49.75,82.55 | J2.4 27.95,86 | 27.95,86 C1.A | v34.2,71.6 34.2,75.7 31.1,78.8 31.1,82.7 | 27.95,86 27.95,85.85 31.1,82.7 | 31.1,82.7 36.3,82.7 36.86,83.26 | 34.2,62.2 v34.2,64.7 | C8.A 26.6,73.2 v26,72.6
  Bottom 0.508: v43.73,72.23 44.33,72.23 45.06,71.5 53,71.5 v53.2,71.7 53.6,71.7 54.66,70.64 71.04,70.64 72.9,72.5 72.9,76.7 71.19,78.41 R9.1 | R39.1 78.25,58.24 80.83,55.66 D6.3
  Bottom 1.27: v34.2,71.6 34.42,71.82 38.68,71.82 39.84,70.66 SJ1.1 43.3,71.8 v43.73,72.23 | v34.2,71.6 33.98,71.82 25.9,71.82 | 25.9,71.82 6.68,71.82 5.6,72.9 5.6,79.4 arc-41 S1.1 | v34.2,71.6 v34.2,64.7 | v26,72.6 26,71.92 25.9,71.82
5VREG  (via drill 0.35)
  Top 0.508: R1.2 40.9,69.6 40.8,69.5 | PIEZO1-SMT.+ 30.65,70.5
  Top 0.813: J1.COIL- 85.65,44.35 86.3,45 86.3,49.7 | D12.C 61.5,69.8 61.2,69.5 | U$1.19 89.15,52.05 88.4,51.3 87.9,51.3 86.3,49.7 | D51.C 86,50 86.3,49.7
  Top 1.27: 56.5,69.5 56.8,69.8 C7.A 57.7,74.3 IC6.3
  Top 2.54: U$1.19 89.15,67.95 87.6,69.5 61.2,69.5 56.5,69.5 40.8,69.5 38.72,69.5 C36.+ 33.72,68.68 v31.9,70.5 30.65,70.5 19.46,70.5 L5.1
  pour Top (no thermals): 11.9,68.6 14.7,68.6 16.1,67.2 21.5,67.2 21.5,71.7 15.8,71.7 15.8,70.9 14.1,69.2 11.9,69.2
BEEPER
  Bottom 0.508: R89.2 78.06,72.75 78.06,69.23 77.77,68.93 77.77,68.1 U$1.15
BEEPER-GND
  Bottom 0.508: Q2.3 67.1,72.76 66.3,71.96 55.28,71.96 54,73.25 52.5,73.25 52.08,72.82 45.68,72.82 44.54,73.96 42.47,73.96 41.77,74.66 40.01,74.66 38.47,76.2 PIEZO1-SMT.-
COIL-1
  Top 0.813: J1.COIL+ 87.95,44.35 87.3,45 87.3,49.1 88.2,50 D51.A 90.2,50.61 90.2,64.9 91.2,65.9 91.2,68.9 86.27,73.83 Q1.3
DHT11  (via drill 0.35)
  Top 0.508: v70,71.5 70.2,71.5 70.4,71.3 76.8,71.3 v77.2,71.7
  Bottom 0.508: U$1.13 73.91,67.91 74.5,68.5 76.4,68.5 77.4,69.5 77.4,71.5 v77.2,71.7 77.4,71.9 77.4,77.09 R9.2 | v70,71.5 69.8,71.3 55.01,71.3 53.73,72.58 52.77,72.58 52.35,72.16 45.41,72.16 44.27,73.3 42.2,73.3 41.5,74 40.1,74 39,72.9 27.3,72.9 26.5,73.7 25.6,73.7 24.76,72.86 9.7,72.86 9.3,73.26 9.3,77.57 S1.2
GND  (via drill 0.35, 3.2 pad 5, 3.2 pad 6)  (77 unrouted)
  Top 0.813: C35.C 12.2,64.9 v13.3,64.9 | IC5.4 12.81,70 v10.8,70 | D15.2 25.48,68.18 v25.5,68.2 | D12.A v61.5,81.7
  Top 1.27: IC6.1 51.45,76.25 v51.4,76.3
  other vias: 7.4,61.4 7,1.5 83.1,25.6 71.1,54.9 53.2,54.3 35.3,54.2 17.6,54.2 44,61.8 54.7,61.4 86,15 23.3,76.6 3,67 97,67 97,28 3,28
  pour Top (rank 6, no thermals): 0,0 100,0 100,100 0,100
  pour Bottom (rank 6, no thermals): 0,0 100,0 100,100 0,100
GPIO4
  Bottom 0.254: 36.44,86.79 41.87,86.79 42.77,87.69 65.03,87.69 65.44,88.11 72.49,88.11 U$1.26
GPIO5
  Bottom 0.254: 34.05,87.2 41.7,87.2 42.61,88.11 46.27,88.11 46.28,88.1 64.86,88.1 U$1.29
IRRECV  (via drill 0.35)
  Top 0.254: v82.8,84.4 82.3,84.9 81.03,84.9 80.53,85.4 80.53,88.53 U$1.23
  Bottom 0.254: D6.1 82.26,61.7 89.35,61.7 90.75,63.1 90.75,84.33 90.22,84.86 83.25,84.86 v82.8,84.4
IRSEND
  Bottom 0.508: U$1.12 72.89,68.4 73.47,68.4 74.23,69.16 76.1,69.16 76.74,69.8 76.74,71.05 76.42,71.38 76.42,72.03 76.74,72.35 76.74,77.36 76.84,77.46 76.89,77.51 77.5,78.12 77.5,82.19 R6.2
IRSNDGND
  Bottom 0.508: Q11.3 65.5,79.03 65.5,73.52 64.6,72.62 55.56,72.62 54.27,73.91 52.23,73.91 51.8,73.48 45.96,73.48 44.82,74.62 42.75,74.62 42.05,75.32 40.28,75.32 38.7,76.9 38.7,78.75 37.9,79.55 12.52,79.55 7.7,84.37 7.7,87.33 D5.K
N$1
  pour Top (no thermals): 82.5,43.1 82.5,33.2 85,30.7 85,26.5 88.5,26.5 88.5,30.7 91.5,33.7 91.5,43.1
N$2
  Top 0.508: IC2.5 10.85,44.96 R4.2 R3.1
N$3
  pour Top (no thermals): 11.9,67 14.3,67 14.5,66.8 14.5,63 24.9,63 24.9,66.7 16,66.7 14.6,68.1 11.9,68.1
N$4
  Top 0.508: IC2.6 11.23,42.42 R4.1 7.69,38.88 R5.2
N$5
  Top 0.508: IC1.5 28.85,44.96 R23.2 R19.1
N$6
  Top 0.508: IC1.6 29.23,42.42 R23.1 25.69,38.88 R24.2
N$7
  pour Top (no thermals): 16,15 19,15 19,11 17,11 17,4 21,4 21,17 16,17
N$8
  Bottom 0.508: R1.1 40.8,80.31 12.79,80.31 10.46,82.64 10.46,87.11 D5.A
N$9
  Bottom 0.508: R6.1 R7.1 70.4,81 69.5,81.9 Q11.2
N$11
  Bottom 0.508: R89.1 R88.1 69.2,76 Q2.2
N$13
  Top 0.508: IC2.9 20.27,42.42 R12.2 24.31,38.38 R11.1
N$14
  Top 0.508: IC2.10 20.65,44.96 R12.1 R13.2
N$16
  Top 0.508: Q10.1 11.96,18.54 13,17.5 R73.1 R44.2
N$17
  pour Top (no thermals): 89,26.5 89,30.5 92,33.5 92,45 91.5,45.5 88.5,45.5 88.5,48 92.5,48 93.5,47 93.5,26.5
N$18
  Top 0.508: Q9.1 20.96,18.54 22,17.5 R72.1 R45.2
N$19
  Top 0.508: Q8.1 29.96,18.54 31,17.5 R67.1 R46.2
N$20
  Top 0.508: IC1.9 38.27,42.42 R34.2 42.31,38.38 R33.1
N$21
  Top 0.508: IC1.10 38.65,44.96 R34.1 R35.2
N$23
  Top 0.508: Q7.1 38.96,18.54 40,17.5 R66.1 R47.2
N$24
  Top 0.508: IC3.5 46.85,44.96 R42.2 R41.1
N$25
  Top 0.508: IC3.6 47.23,42.42 R42.1 43.69,38.88 R43.2
N$26
  pour Top (no thermals): 84.5,26.5 84.5,30.5 82,33 82,45 82.5,45.5 85.5,45.5 85.5,48 81.5,48 80.5,47 80.5,26.5
N$27
  Top 0.508: Q6.1 47.96,18.54 49,17.5 R64.1 R51.2
N$28
  Top 0.508: IC3.9 56.27,42.42 R50.2 60.31,38.38 R49.1
N$29
  Top 0.508: IC3.10 56.65,44.96 R50.1 R53.2
N$30
  Bottom 0.508: SJ1.2 43.43,69.01 U$1.1
N$31
  Top 0.508: Q5.1 56.96,18.54 58,17.5 R63.1 R52.2
N$32
  Top 0.508: IC4.5 64.85,44.96 R60.2 R59.1
N$33
  Top 0.508: IC4.6 65.23,42.42 R60.1 61.69,38.88 R61.2
N$35
  Top 0.508: Q4.1 65.96,18.54 67,17.5 R57.1 R54.2
N$36
  Top 0.508: IC4.9 74.27,42.42 R70.2 77,37.31 R69.1
N$37
  Top 0.508: Q3.1 74.96,18.54 76,17.5 R56.1 R55.2
N$38
  Top 0.508: IC4.10 74.65,44.96 R70.1 R71.2
N$41  (1 unrouted)
  pour Top (no thermals): 70,15 73,15 73,11 71,11 71,4 75,4 75,17 70,17
N$42
  pour Top (no thermals): 61,15 64,15 64,11 62,11 62,4 66,4 66,17 61,17
N$43
  pour Top (no thermals): 52,15 55,15 55,11 53,11 53,4 57,4 57,17 52,17
N$44
  pour Top (no thermals): 43,15 46,15 46,11 44,11 44,4 48,4 48,17 43,17
N$45
  pour Top (no thermals): 34,15 37,15 37,11 35,11 35,4 39,4 39,17 34,17
N$46
  pour Top (no thermals): 7,15 10,15 10,11 8,11 8,4 12,4 12,17 7,17
N$47
  pour Top (no thermals): 25,15 28,15 28,11 26,11 26,4 30,4 30,17 25,17
N$74
  Top 0.508: R90.1 R91.1 87.59,81 Q1.2
OUT1  (via drill 0.35)
  Top 0.254: U$1.27 69.87,88.03 69.87,84.84 69.5,84.47 v69.5,84.1
  Bottom 0.254: R44.1 16.09,21.9 24.52,21.9 24.92,22.31 33.35,22.31 33.75,22.71 42.18,22.71 42.59,23.12 51.01,23.12 51.42,23.53 60.34,23.53 60.65,23.83 68.57,23.83 68.98,24.24 76.81,24.24 77.22,24.64 78.12,24.64 78.36,24.88 78.36,32.55 79.3,33.5 79.3,36.4 77.94,37.76 77.94,52.34 79.8,54.2 90.35,54.2 91.16,55 91.16,84.5 90.39,85.26 74.24,85.26 73.83,84.86 70.25,84.86 v69.5,84.1
OUT2  (via drill 0.35)
  Top 0.254: U$1.28 69.33,89.03 69.33,85.54 v68.8,85.01
  Bottom 0.254: R45.1 25.09,21.9 33.52,21.9 33.92,22.31 42.35,22.31 42.75,22.71 51.18,22.71 51.59,23.12 60.51,23.12 60.82,23.43 68.74,23.43 69.15,23.83 76.98,23.83 77.39,24.24 78.29,24.24 78.76,24.71 78.76,32.39 79.71,33.33 79.71,36.57 78.35,37.93 78.35,52.17 79.97,53.79 90.52,53.79 91.56,54.84 91.56,84.67 90.56,85.67 74.07,85.67 73.67,85.26 69.05,85.26 v68.8,85.01
OUT3  (via drill 0.35)
  Top 0.254: U$1.30 63.75,85.57 63.86,85.46 63.86,85.05 v63.91,85
  Bottom 0.254: R46.1 34.09,21.9 42.52,21.9 42.92,22.31 51.35,22.31 51.75,22.71 60.68,22.71 60.98,23.02 68.91,23.02 69.32,23.43 77.15,23.43 77.56,23.83 78.46,23.83 79.17,24.54 79.17,32.22 80.11,33.16 80.11,36.74 78.75,38.1 78.75,52 80.14,53.39 90.69,53.39 91.97,54.67 91.97,84.83 90.73,86.07 73.9,86.07 73.5,85.67 66.45,85.67 66.04,85.25 64.16,85.25 v63.91,85
OUT4  (via drill 0.35)
  Top 0.254: U$1.31 61.21,85.62 61.3,85.53 v61.3,85.41
  Bottom 0.254: R47.1 43.09,21.9 51.52,21.9 51.92,22.31 60.85,22.31 61.15,22.61 69.08,22.61 69.48,23.02 77.32,23.02 77.73,23.43 78.63,23.43 79.57,24.37 79.57,32.05 80.52,32.99 80.52,36.91 79.16,38.27 79.16,51.84 80.31,52.98 90.86,52.98 92.37,54.5 92.37,85 90.89,86.48 73.73,86.48 73.33,86.07 66.28,86.07 65.87,85.66 61.55,85.66 v61.3,85.41
OUT5  (via drill 0.35)
  Top 0.254: U$1.33 56.13,86.71 56.2,86.64 56.2,86.32 v56.7,85.82
  Bottom 0.254: R51.1 52.09,21.9 61.02,21.9 61.32,22.21 69.25,22.21 69.65,22.61 77.49,22.61 77.89,23.02 78.8,23.02 79.98,24.2 79.98,31.88 80.93,32.83 80.93,37.07 79.56,38.43 79.56,51.67 80.47,52.57 91.03,52.57 92.78,54.33 92.78,85.17 91.06,86.89 73.57,86.89 73.16,86.48 66.11,86.48 65.7,86.07 56.95,86.07 v56.7,85.82
OUT6  (via drill 0.35)
  Top 0.254: U$1.36 48.4,89.42 v48.4,86.22
  Bottom 0.254: R52.1 61.49,21.8 69.42,21.8 69.82,22.21 77.66,22.21 78.06,22.61 78.96,22.61 80.39,24.04 80.39,31.71 81.33,32.66 81.33,37.24 79.97,38.6 79.97,51.5 80.64,52.17 91.19,52.17 93.19,54.16 93.19,85.34 91.23,87.29 73.4,87.29 72.99,86.89 65.95,86.89 65.53,86.47 48.65,86.47 v48.4,86.22
OUT7  (via drill 0.35)
  Top 0.254: v46,86.55 45.97,86.58 U$1.37
  Bottom 0.254: R54.1 69.99,21.8 77.83,21.8 78.23,22.21 79.13,22.21 80.79,23.87 80.79,31.55 81.74,32.49 81.74,37.41 80.38,38.77 80.38,51.33 80.81,51.76 91.36,51.76 93.59,53.99 93.59,85.51 91.4,87.7 73.23,87.7 72.82,87.29 65.78,87.29 65.36,86.88 46.33,86.88 v46,86.55
OUT8  (via drill 0.35)
  Top 0.254: v65.76,63.67 64.83,63.67 64.67,63.51 63.89,63.51 63.6,63.8 63.6,64.3 63.75,64.45 U$1.9 | v78.5,60.5 78.5,59.7 79.34,58.85 79.34,52.69 v81.04,51
  Bottom 0.254: R55.1 78,21.4 78.4,21.8 79.3,21.8 81.2,23.7 81.2,31.38 82.14,32.32 82.14,37.58 80.78,38.94 80.78,50.75 v81.04,51 | v65.76,63.67 65.76,63.31 66.58,62.5 75,62.5 77,60.5 v78.5,60.5
RF-DATA  (via drill 0.35)
  Top 0.254: v41.1,86.1 40.2,87 39.69,87 J2.2 34.57,89.83 J2.3
  Bottom 0.254: U$1.25 76.45,88.45 76.11,88.11 73.06,88.11 72.66,87.7 65.61,87.7 65.2,87.29 42.94,87.29 41.75,86.1 v41.1,86.1
SIREN
  Top 0.508: U$1.24 80,88.52 80,84.69 R90.2
VM  (via drill 0.35)
  Top 0.813: 16.69,35 R10.2 18.69,32 34.5,32 | 16.69,35 R11.2 16.69,46.81 13.46,50.04 IC2.3 | R2.2 16.69,35 | 34.69,35 R32.2 34.69,32.19 34.5,32 | 34.69,35 R33.2 34.69,46.81 31.46,50.04 IC1.3 | R18.2 34.69,35 | 52.69,35 R48.2 52.69,32.19 52.5,32 | 52.69,35 R49.2 52.69,46.81 49.46,50.04 IC3.3 | R40.2 52.69,35 | 70.69,35 R68.2 70.69,32.69 70,32 52.5,32 | 70.69,35 R69.2 70.69,46.81 67.46,50.04 IC4.3 | R58.2 70.69,35 | 34.5,32 52.5,32
  Top 1.27: v8.7,62.4 8.6,62.5 C35.A 10.89,66.39 IC5.1 | 70,32 70,24.5 71.5,23 79,23 80,22 80,11.1 76.41,7.5 X3.1
  Bottom 0.508: IC1.3 27.96,50.04 26.5,51.5 R19.2 | IC3.3 45.96,50.04 44.5,51.5 R41.2 | IC4.3 63.96,50.04 62.5,51.5 R59.2
  Bottom 1.27: IC2.3 11.46,50.04 10,51.5 10,57 | 10,57 10,59.82 8.7,61.12 v8.7,62.4 9.71,63.41 21.05,63.41 21.45,63.82 23.12,63.82 26.1,66.8 C12.+ | R3.2 9.69,57.31 10,57
  pour Top (no thermals): 8,3.5 12.5,3.5 12.5,11 16.5,11 16.5,3.5 21.5,3.5 21.5,11 25.5,11 25.5,3.5 30.5,3.5 30.5,11 34.5,11 34.5,3.5 39.5,3.5 39.5,11 43.5,11 43.5,3.5 48.5,3.5 48.5,11 52.5,11 52.5,3.5 57.5,3.5 57.5,11 61.5,11 61.5,3.5 66.5,3.5 66.5,11 70.5,11 70.5,3.5 75.5,3.5 75.5,11 80.5,11 80.5,4.3 85,4.3 85,10.5 93.5,10.5 93.5,0.5 8,0.5
ZONE1
  Top 0.508: IC2.4 13,47.5 14,46.5 14,41 12.88,39.88 IC2.7 10.38,39.88 9,38.5 9,36.31 R2.1
  Bottom 0.813: X10.1 13.4,29.29 R2.1
ZONE1-CLOSED  (via drill 0.35)
  Top 0.254: v64.4,64.17 64.4,65.2 66.08,66.88 U$1.10
  Bottom 0.254: PAD1.1 13,62.5 21.43,62.5 21.83,62.91 30.26,62.91 30.66,63.31 38.79,63.31 39.9,64.42 64.15,64.42 v64.4,64.17
  Bottom 0.508: IC2.2 IC2.1 12.19,56.37 14.16,58.34 | PAD1.1 14.16,58.34 | 14.16,58.34 R8.2
ZONE2
  Top 0.508: IC2.11 18.5,47.5 18,47 18,40.5 18.62,39.88 IC2.8 21.12,39.88 23,38 23,35.31 R10.1
  Bottom 0.813: X9.1 22.41,32.09 R10.1
ZONE2-CLOSED  (via drill 0.35)
  Top 0.254: v67.1,64.17 67.1,65.15 U$1.11
  Bottom 0.254: PAD2.1 22,62.5 30.43,62.5 30.83,62.91 38.96,62.91 40.06,64.01 63.62,64.01 64.13,63.51 64.67,63.51 65.58,64.42 66.85,64.42 v67.1,64.17
  Bottom 0.508: IC2.13 IC2.14 19.81,59.01 19.16,59.66 | R16.2 19.16,59.66 | 19.16,59.66 PAD2.1
ZONE3
  Top 0.508: IC1.4 31,47.5 32,46.5 32,41 30.88,39.88 IC1.7 28.38,39.88 27,38.5 27,36.31 R18.1
  Bottom 0.813: X11.1 31.41,29.29 R18.1
ZONE3-CLOSED  (via drill 0.35)
  Top 0.254: v58.83,63.35 59,63.52 59,66.55 U$1.7
  Bottom 0.254: PAD3.1 31,62.5 39.12,62.5 40.23,63.61 58.58,63.61 v58.83,63.35
  Bottom 0.508: IC1.2 IC1.1 30.19,56.37 32.16,58.34 | PAD3.1 32.16,58.34 | 32.16,58.34 R28.2
ZONE4
  Top 0.508: IC1.11 36.5,47.5 36,47 36,40.5 36.62,39.88 IC1.8 39.12,39.88 41,38 41,35.31 R32.1
  Bottom 0.813: X12.1 40.41,32.09 R32.1
ZONE4-CLOSED  (via drill 0.35)
  Top 0.254: v59.74,63.35 59.74,63.56 59.41,63.89 59.41,65.71 60.58,66.88 U$1.8
  Bottom 0.254: PAD4.1 38.5,61.3 40.4,63.2 58.06,63.2 58.56,62.7 59.1,62.7 59.49,63.08 59.49,63.1 v59.74,63.35
  Bottom 0.508: IC1.13 IC1.14 37.81,59.01 37.16,59.66 | R29.2 37.16,59.66 | 37.16,59.66 PAD4.1
ZONE5
  Top 0.508: IC3.4 49,47.5 50,46.5 50,41 48.88,39.88 IC3.7 46.88,39.88 45,38 45,36.31 R40.1
  Bottom 0.813: X13.1 49.41,29.29 R40.1
ZONE5-CLOSED  (via drill 0.35)
  Top 0.254: v49.65,61.9 49.67,61.9 50.28,61.28 51.02,61.28 51.96,62.23 51.96,62.77 51.71,63.02 51.71,65.51 53.08,66.88 U$1.5
  Bottom 0.254: v49.65,61.9 49.55,61.8 48.3,61.8 PAD5.1
  Bottom 0.508: IC3.2 IC3.1 48.19,56.37 50.16,58.34 | PAD5.1 50.16,58.34 | 50.16,58.34 R36.2
ZONE6
  Top 0.508: IC3.11 54.5,47.5 54,47 54,40.5 54.62,39.88 IC3.8 56.62,39.88 59,37.5 59,35.31 R48.1
  Bottom 0.813: X14.1 58.41,32.09 R48.1
ZONE6-CLOSED
  Top 0.254: PAD6.1 56.5,61.2 56.13,61.57 U$1.6
  Bottom 0.508: IC3.13 IC3.14 55.81,59.01 55.16,59.66 | R37.2 55.16,59.66 | 55.16,59.66 PAD6.1
ZONE7
  Top 0.508: IC4.4 67,47.5 68,46.5 68,41 66.88,39.88 IC4.7 65.38,39.88 63,37.5 63,36.31 R58.1
  Bottom 0.813: X15.1 67.41,29.29 R58.1
ZONE7-CLOSED  (via drill 0.35)
  Top 0.254: v50.56,61.94 50.56,62.74 50.89,63.08 50.89,65.06 49.08,66.88 U$1.3
  Bottom 0.254: v50.56,61.94 50.76,61.94 50.9,61.8 51.53,61.8 52.12,62.39 57.72,62.39 58.22,61.88 59.44,61.88 59.85,62.29 60.18,62.29 61.09,63.2 63.29,63.2 63.79,62.7 64.7,62.7 65.5,61.9 PAD7.1
  Bottom 0.508: IC4.2 IC4.1 66.19,56.37 68.16,58.34 | PAD7.1 68.16,58.34 | 68.16,58.34 R38.2
ZONE8
  Top 0.508: IC4.11 72.5,47.5 72,47 72,40.5 72.62,39.88 IC4.8 74.12,39.88 76,38 76,36.31 R68.1
  Bottom 0.813: X16.1 76.41,32.09 R68.1
ZONE8-CLOSED  (via drill 0.35)
  Top 0.254: U$1.4 51.05,65.65 51.3,65.4 v51.3,62.5
  Bottom 0.254: v51.3,62.5 51.59,62.79 57.89,62.79 58.39,62.29 59.27,62.29 59.68,62.7 60.01,62.7 60.92,63.61 63.46,63.61 63.96,63.1 65.4,63.1 66.41,62.09 73.41,62.09 PAD8.1
  Bottom 0.508: IC4.13 IC4.14 73.81,59.01 73.16,59.66 | R39.2 73.16,59.66 | 73.16,59.66 PAD8.1

### Text on the board
tPlace: IR / TX | RF | + | 3V3 | DATA | GND | I2C | IO5 | IO4 | 3V3 | GND | 12 | BEEPER | IR-RX | ZONE1 | ZONE2 | ZONE3 | ZONE4 | ZONE5 | ZONE6 | ZONE7 | ZONE8 | RELAY | OUT1 | OUT2 | OUT3 | OUT4 | OUT5 | OUT6 | OUT7 | OUT8 | - PWR +
bPlace: INT3V3